# Altium schematic sheet H_bridge.SchDoc
size B
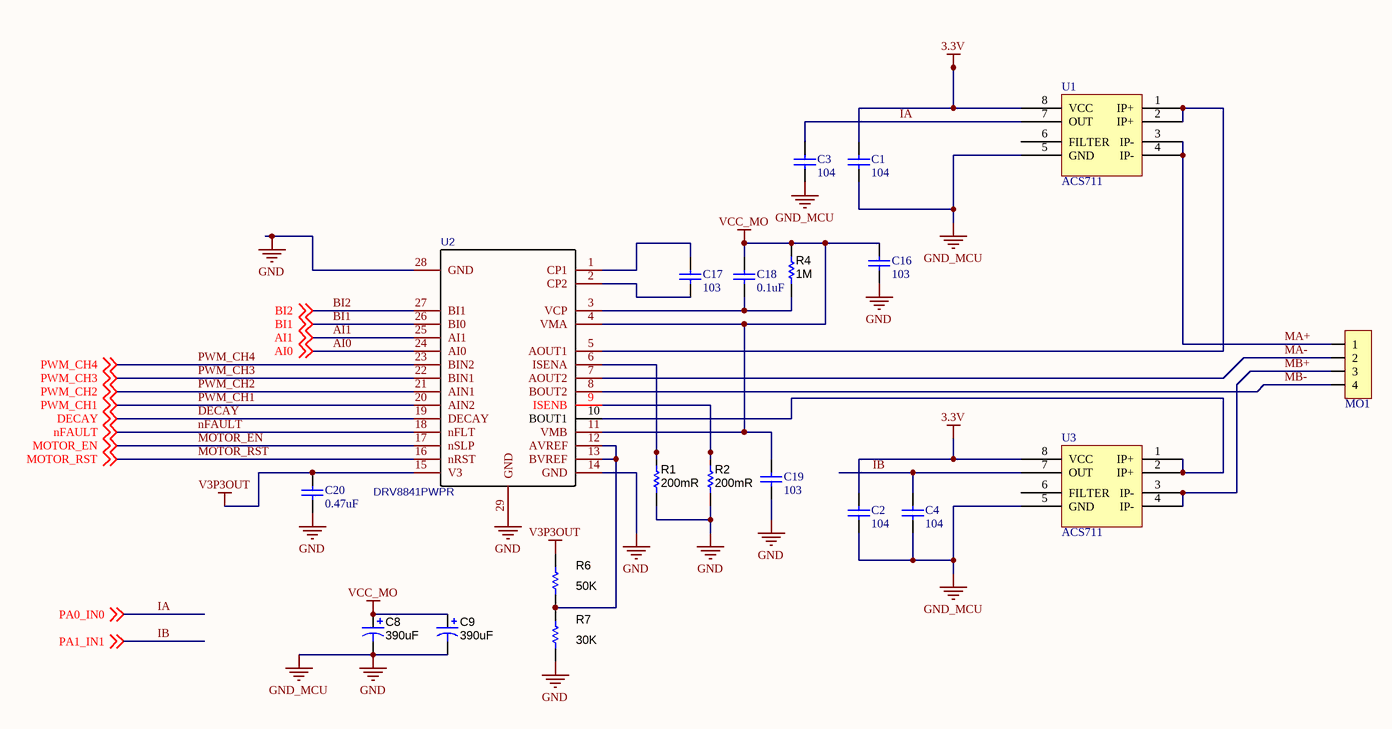
[diagram p0: H_bridge.SchDoc]

## Parts
C1  104  [0805_HV]
C2  104  [0805_HV]
C3  104  [0805_HV]
C4  104  [0805_HV]
C8  390uF  [CP1/3.0]
C9  390uF  [CP1/3.0]
C16  103  [0805_HV]
C17  103  [0805_HV]
C18  0.1uF  [0805_HV]
C19  103  [0805_HV]
C20  0.47uF  [0805_HV]
MO1  Header 4_MH  [HEADER 4]  (value not drawn)
R1  ValueDisplayed: 200mR  [1210]  (hidden comment: RT0603DRE07140KL)
R2  ValueDisplayed: 200mR  [1210]  (hidden comment: RT0603DRE07140KL)
R4  1M  [0805_HV]
R6  50K  [0805_HV]
R7  30K  [0805_HV]
U1  ACS711  [SOP 8]
U2  DRV8841PWPR  [TSSOP-28EP]
U3  ACS711  [SOP 8]

## Nets
3.3V: C1.2 C2.2 U1.8(VCC) U3.8(VCC)
GND: C1.1 C2.1 C3.1 C4.1 C8.2(-) C9.2(-) C16.1 C19.1 C20.1 R1.1 R2.1 R7.1 U1.5(GND) U2.14(GND) U2.28(GND) U2.29(GND) U3.5(GND)  [also labelled GND_MCU]
V3P3OUT: C20.2 R6.2 U2.15(V3)
VCC_MO: C8.1(+) C9.1(+) C16.2 C18.2 C19.2 R4.2 U2.4(VMA) U2.11(VMB)
AI0: U2.24(AI0) ; off-sheet AI0
AI1: U2.25(AI1) ; off-sheet AI1
BI1: U2.26(BI0) ; off-sheet BI1
BI2: U2.27(BI1) ; off-sheet BI2
DECAY: U2.19(DECAY) ; off-sheet DECAY
IA: C3.2 U1.7(OUT) ; off-sheet PA0_IN0  [also labelled PA0_IN0]
IB: C4.2 U3.7(OUT) ; off-sheet PA1_IN1  [also labelled PA1_IN1]
MA+: MO1.1 U1.3(IP-) U1.4(IP-)
MA-: MO1.2 U2.7(AOUT2)
MB+: MO1.3 U3.3(IP-) U3.4(IP-)
MB-: MO1.4 U2.8(BOUT2)
MOTOR_EN: U2.17(nSLP) ; off-sheet MOTOR_EN
MOTOR_RST: U2.16(nRST) ; off-sheet MOTOR_RST
nFAULT: U2.18(nFLT) ; off-sheet nFAULT
PWM_CH1: U2.20(AIN2) ; off-sheet PWM_CH1
PWM_CH2: U2.21(AIN1) ; off-sheet PWM_CH2
PWM_CH3: U2.22(BIN1) ; off-sheet PWM_CH3
PWM_CH4: U2.23(BIN2) ; off-sheet PWM_CH4
NetC17_1: C17.1 U2.2(CP2)
NetC17_2: C17.2 U2.1(CP1)
NetC18_1: C18.1 R4.1 U2.3(VCP)
NetR1_2: R1.2 U2.6(ISENA)
NetR2_2: R2.2 U2.9(ISENB)
NetR6_1: R6.1 R7.2 U2.12(AVREF) U2.13(BVREF)
NetU1_1: U1.1(IP+) U1.2(IP+) U2.5(AOUT1)
NetU2_10: U2.10(BOUT1) U3.1(IP+) U3.2(IP+)

Not connected (* = marked no-connect by the designer): U1 6(FILTER); U3 6(FILTER)

## Library data of the parts
C1-C4 C16-C20 = Capacitor 0805: Ceramic Chip Capacitor - Standard; Note: Footprint corresponds to dimensions for bulk cassette packaging. This case size has tightened tolerances.; Published: 17-Jul-2002; LatestRevisionDate: 19-Mar-2004; LatestRevisionNote: Silkscreen size reduced.; DatasheetDocument: Mar-2001; PackageDocument: Mar-2001; PackageReference: 0805; Publisher: Altium Limited; Code_JEITA: 0805; Code_IPC: 2012[0805]; ComponentLink1Description: Manufacturer Link; ComponentLink1URL: http://www.kemet.com/; ComponentLink2Description: Datasheet; ComponentLink2URL: http://www.kemet.com/kemet/web/homepage/kechome.nsf/vapubfilesname/F3102TA.pdf/$file/F3102TA.pdf
  C1-C4: Value: 104
  C16 C17 C19: Value: 103
  C18: Value: 0.1uF
  C20: Value: 0.47uF
C8 C9 = Capacitor TuHoa: PartNumber: UHW1H391MPD6; Manufacturer: Nichicon; Polarized: Y; U/M: EA; Cap_F: 0.000390; Tolerance_%: 20; Value1: Unknown; VDC_V: 50; Value2: 50V; TaMin_C: -40; TaMax_C: 105; Cap_Case: 10x22; AEC Category: Q200; AEC Qualified: N; CompType: Capacitor; SymbolVersion: 2008-07-09; Value: 390uF; PackageReference: 10x22; RoHS: Y; MountType: TH; Technology: AL; Series: ZL; Publisher: Texas Instruments; LatestRevisionDate: 2015-12-17; ComponentLink1Description: Datasheet link; ComponentLink1URL: http://nichicon-us.com/english/products/pdfs/e-uhw.pdf; Supplier 1: Digi-Key; Supplier Part Number 1: 493-6885-ND; AEC Grade: N/A; ValueDisplayed: 390uF
MO1 = Header 4_MH: Header 4P XH2.54 thẳng
R1 R2 = RT0603DRE07140KL: RES, 140 k, 0.5%, 0.1 W, 0603; Manufacturer: Yageo America; CompType: Resistor; Value: 140k; Res_ohm: 140000; Tolerance_%: 0.5; Power_W: 0.1; Value2: 0.1W; VDC_V: 75; TempCo: 50 ppm/C; EIA_Code: E192; U/M: EA; SymbolVersion: 2009-05-29; PartNumber: RT0603DRE07140KL; PackageReference: 0603; RoHS: Y; Value_Code: 140k; Value1: 0.5%; MountType: SMT; Technology: Thin Film; Published: 2008-06-26; Publisher: Texas Instruments; LatestRevisionDate: 2014-09-19; ComponentLink1Description: Datasheet link; ComponentLink1URL: http://www.yageo.com/pdf/PYu-RT_1-to-0.05_RoHS_L_3.pdf
R4 R6 R7 = R nho: RES, 100, 1%, 0.1 W, 0402; PartNumber: ERJ-2RKF1000X; Manufacturer: Panasonic; CompType: Resistor; Res_ohm: 100; Value_Code: 100R; Tolerance_%: 1; Power_W: 0.1; Value2: 0.1W; VDC_V: 50; TempCo: 100 ppm/C; EIA_Code: E96; U/M: EA; AEC Category: Q200; SymbolVersion: 2009-05-29; PackageReference: 0402; RoHS: Y; Value1: 1%; MountType: SMT; Technology: Thick Film; Published: 2008-06-26; Publisher: Texas Instruments; LatestRevisionDate: 2016-01-08; ComponentLink1Description: Datasheet link; ComponentLink1URL: http://industrial.panasonic.com/www-data/pdf/AOA0000/AOA0000CE2.pdf; Supplier 1: Digi-Key; Supplier Part Number 1: P100LCT-ND; Supplier 2: Mouser; Supplier Part Number 2: 667-ERJ-2RKF1000X; Supplier 3: Farnell; Supplier Part Number 3: 2304034; AEC Qualified: ?
  R4: Value: 1M
  R6: Value: 50K
  R7: Value: 30K
U1 U3 = ACS712
U2 = DRV8841PWPR: BOM_Manufacturer: TI; SMT Type: Extend; BOM_Supplier: LCSC; BOM_Manufacturer Part: DRV8841PWPR; image: //image.lceda.cn/szlcsc/C36542.jpg; BOM_Supplier Part: C36542; BOM_LCSC Assembly: Yes; spicePre: U